# Altium schematic sheet Sheet1.SchDoc
size A4
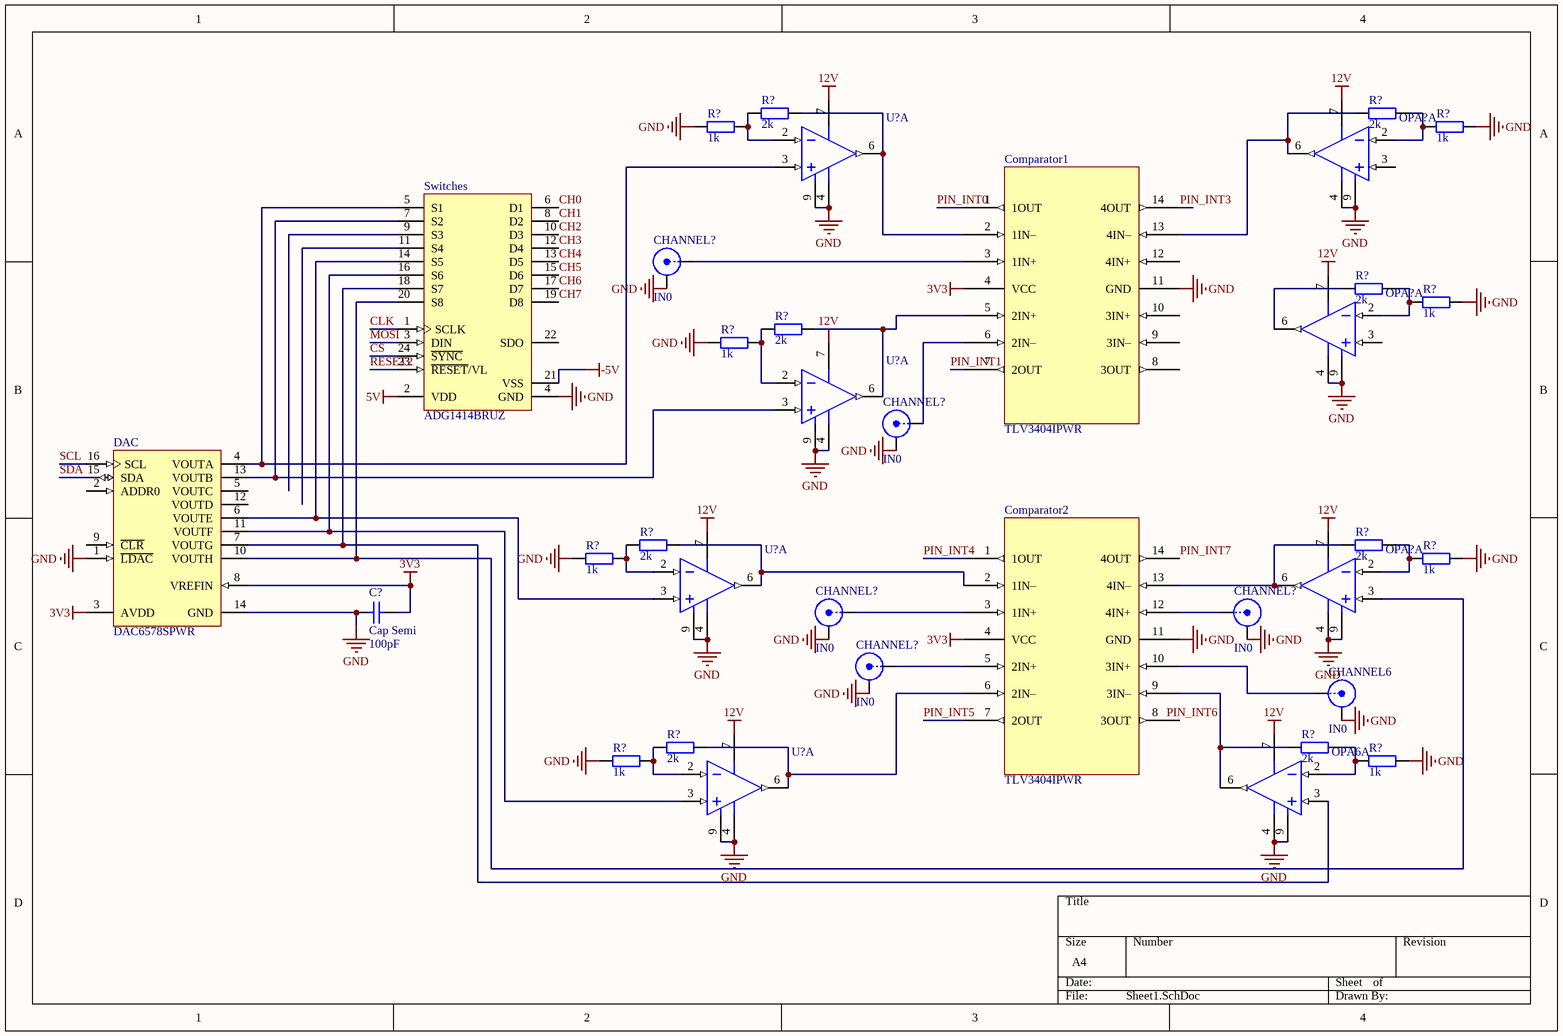
[diagram p0: Sheet1.SchDoc]

## Parts
(Parts that share a designator on the sheet are numbered #1, #2 ... from top to bottom, then left to right.)
C?  Cap Semi  value 100pF  [C1206]
CHANNEL6  IN0  [SMB]
CHANNEL?#1  IN0  [SMB]
CHANNEL?#2  IN0  [SMB]
CHANNEL?#3  IN0  [SMB]
CHANNEL?#4  IN0  [SMB]
CHANNEL?#5  IN0  [SMB]
Comparator1  TLV3404IPWR  [TSSOP-14]
Comparator2  TLV3404IPWR  [TSSOP-14]
DAC  DAC6578SPWR  [TI-PW16_N]
OPA6  THS3001IDGNG4  [TI-DGN8-1760X1425TP_M]  (value not drawn)  (part A of 2)
OPA?#1  THS3001IDGNG4  [TI-DGN8-1760X1425TP_M]  (value not drawn)  (part A of 2)
OPA?#2  THS3001IDGNG4  [TI-DGN8-1760X1425TP_M]  (value not drawn)  (part A of 2)
OPA?#3  THS3001IDGNG4  [TI-DGN8-1760X1425TP_M]  (value not drawn)  (part A of 2)
R?#1  value 2k  [0805]  (hidden comment: 1k-0W25-0805)
R?#2  value 2k  [0805]  (hidden comment: 1k-0W25-0805)
R?#3  value 1k  [0805]  (hidden comment: 1k-0W25-0805)
R?#4  value 1k  [0805]  (hidden comment: 1k-0W25-0805)
R?#5  value 2k  [0805]  (hidden comment: 1k-0W25-0805)
R?#6  value 1k  [0805]  (hidden comment: 1k-0W25-0805)
R?#7  value 2k  [0805]  (hidden comment: 1k-0W25-0805)
R?#8  value 1k  [0805]  (hidden comment: 1k-0W25-0805)
R?#9  value 2k  [0805]  (hidden comment: 1k-0W25-0805)
R?#10  value 2k  [0805]  (hidden comment: 1k-0W25-0805)
R?#11  value 1k  [0805]  (hidden comment: 1k-0W25-0805)
R?#12  value 1k  [0805]  (hidden comment: 1k-0W25-0805)
R?#13  value 2k  [0805]  (hidden comment: 1k-0W25-0805)
R?#14  value 2k  [0805]  (hidden comment: 1k-0W25-0805)
R?#15  value 1k  [0805]  (hidden comment: 1k-0W25-0805)
R?#16  value 1k  [0805]  (hidden comment: 1k-0W25-0805)
Switches  ADG1414BRUZ  [ADI-RU-24_N]
U?#1  THS3001IDGNG4  [TI-DGN8-1760X1425TP_M]  (value not drawn)  (part A of 2)
U?#2  THS3001IDGNG4  [TI-DGN8-1760X1425TP_M]  (value not drawn)  (part A of 2)
U?#3  THS3001IDGNG4  [TI-DGN8-1760X1425TP_M]  (value not drawn)  (part A of 2)
U?#4  THS3001IDGNG4  [TI-DGN8-1760X1425TP_M]  (value not drawn)  (part A of 2)

## Nets
3V3: C?.2 Comparator1.4(VCC) Comparator2.4(VCC) DAC.3(AVDD) DAC.8(VREFIN)
5V: Switches.2(VDD)
12V: OPA6.7(VCC+) OPA?#1.7(VCC+) OPA?#2.7(VCC+) OPA?#3.7(VCC+) U?#1.7(VCC+) U?#2.7(VCC+) U?#3.7(VCC+) U?#4.7(VCC+)
-5V: Switches.21(VSS)
GND: C?.1 CHANNEL6.2(Y) CHANNEL?#1.2(Y) CHANNEL?#2.2(Y) CHANNEL?#3.2(Y) CHANNEL?#4.2(Y) CHANNEL?#5.2(Y) Comparator1.11(GND) Comparator2.11(GND) DAC.1(~{LDAC}) DAC.14(GND) OPA6.4(VCC-) OPA6.9(EP) OPA?#1.4(VCC-) OPA?#1.9(EP) OPA?#2.4(VCC-) OPA?#2.9(EP) OPA?#3.4(VCC-) OPA?#3.9(EP) R?#3.1 R?#4.2 R?#6.2 R?#8.1 R?#11.1 R?#12.2 R?#15.1 R?#16.2 Switches.4(GND) U?#1.4(VCC-) U?#1.9(EP) U?#2.4(VCC-) U?#2.9(EP) U?#3.4(VCC-) U?#3.9(EP) U?#4.4(VCC-) U?#4.9(EP)
CH0: Switches.6(D1)
CH1: Switches.8(D2)
CH2: Switches.10(D3)
CH3: Switches.12(D4)
CH4: Switches.13(D5)
CH5: Switches.15(D6)
CH6: Switches.17(D7)
CH7: Switches.19(D8)
CLK: Switches.1(SCLK)
CS: Switches.24(~{SYNC})
MOSI: Switches.3(DIN)
PIN_INT0: Comparator1.1(1OUT)
PIN_INT1: Comparator1.7(2OUT)
PIN_INT3: Comparator1.14(4OUT)
PIN_INT4: Comparator2.1(1OUT)
PIN_INT5: Comparator2.7(2OUT)
PIN_INT7: Comparator2.14(4OUT)
RESET2: Switches.23(~{RESET}/VL)
SCL: DAC.16(SCL)
SDA: DAC.15(SDA)
NetCHANNEL6_1: CHANNEL6.1(X) Comparator2.10(3IN+)
NetCHANNEL?#1_1: CHANNEL?#1.1(X) Comparator1.3(1IN+)
NetCHANNEL?#2_1: CHANNEL?#2.1(X) Comparator1.6(2IN–)
NetCHANNEL?#3_1: CHANNEL?#3.1(X) Comparator2.3(1IN+)
NetCHANNEL?#4_1: CHANNEL?#4.1(X) Comparator2.12(4IN+)
NetCHANNEL?#5_1: CHANNEL?#5.1(X) Comparator2.5(2IN+)
NetComparator1_2: Comparator1.2(1IN–) R?#1.2 U?#1.6(OUT)
NetComparator1_5: Comparator1.5(2IN+) R?#7.2 U?#2.6(OUT)
NetComparator1_13: Comparator1.13(4IN–) OPA?#1.6(OUT) R?#2.1
NetComparator2_2: Comparator2.2(1IN–) R?#9.2 U?#3.6(OUT)
NetComparator2_6: Comparator2.6(2IN–) R?#13.2 U?#4.6(OUT)
NetComparator2_9: Comparator2.9(3IN–) OPA6.6(OUT) R?#14.1
NetComparator2_13: Comparator2.13(4IN–) OPA?#3.6(OUT) R?#10.1
NetDAC_4: DAC.4(VOUTA) Switches.5(S1) U?#1.3(IN+)
NetDAC_6: DAC.6(VOUTE) Switches.14(S5) U?#3.3(IN+)
NetDAC_7: DAC.7(VOUTG) OPA6.3(IN+) Switches.18(S7)
NetDAC_10: DAC.10(VOUTH) OPA?#3.3(IN+) Switches.20(S8)
NetDAC_11: DAC.11(VOUTF) Switches.16(S6) U?#4.3(IN+)
NetDAC_13: DAC.13(VOUTB) Switches.7(S2) U?#2.3(IN+)
NetOPA6_2: OPA6.2(IN-) R?#14.2 R?#16.1
NetOPA?#1_2: OPA?#1.2(IN-) R?#2.2 R?#4.1
NetOPA?#2_2: OPA?#2.2(IN-) R?#5.2 R?#6.1
NetOPA?#2_6: OPA?#2.6(OUT) R?#5.1
NetOPA?#3_2: OPA?#3.2(IN-) R?#10.2 R?#12.1
NetR?#1_1: R?#1.1 R?#3.2 U?#1.2(IN-)
NetR?#7_1: R?#7.1 R?#8.2 U?#2.2(IN-)
NetR?#9_1: R?#9.1 R?#11.2 U?#3.2(IN-)
NetR?#13_1: R?#13.1 R?#15.2 U?#4.2(IN-)

Not connected (* = marked no-connect by the designer): Comparator1 8(3OUT) 9(3IN–) 10(3IN+) 12(4IN+); Comparator2 8(3OUT); DAC 2(ADDR0) 5(VOUTC) 9(~{CLR}) 12(VOUTD); OPA?#1 3(IN+); OPA?#2 3(IN+); Switches 9(S3) 11(S4) 22(SDO)

## Notes on the sheet
- Labels drawn without touching a wire or pin: PIN_INT6

## Library data of the parts
C? = Cap Semi: Capacitor (Semiconductor SIM Model); Published: 8-Jun-2000; LatestRevisionDate: 29-May-2009; LatestRevisionNote: IPC-7351 Footprint Added.; PackageReference: C1206; Publisher: Altium Limited; PackageDescription: Chip Capacitor
CHANNEL6 CHANNEL?#1-CHANNEL?#5 = SMB: SMB Straight Connector; LatestRevisionDate: 17-Jul-2002; LatestRevisionNote: Re-released for DXP Platform.; Publisher: Altium Limited; Supplier 1: Farnell; Supplier Part Number 1: 1206013
DAC = CMP-0004-01130-1: 10-Bit, Octal Channel, Ultra-Low Glitch, Voltage Output, 2-Wire Interface DAC, -40 to 125 degC, 16-pin SOP (PW16), Green (RoHS & no Sb/Br); Manufacturer: Texas Instruments; DAC Channels: 8; INL(Max)(+/-LSB): 0.5; Power Consumption(Typ)(mW): 3.67; Resolution(Bits): 10; SubFamily: Precision DAC (=<10MSPS); Settling Time(us): 7; Interface: Serial I2C; DatasheetVersion: SBAS496A; ComponentLink3Description: Package Specification; Mounting Technology: Surface Mount; ComponentLink1URL: http://www.ti.com/; ComponentLink2Description: Datasheet; Code_JEDEC: MO-153; ComponentLink2URL: http://www.ti.com/general/docs/lit/getliterature.tsp?genericPartNumber=DAC6578&fileType=pdf; ComponentLink3URL: http://www.ti.com/lit/ml/mpds361/mpds361.pdf; DNL(Max)(+/-LSB): 0.5; PackageReference: PW16; PackageVersion: 4040064-4/G, 02/2011; PackageDescription: 16-Pin Plastic Small Outline, Body 5 x 4.4 mm, Pitch 0.65 mm; Eco-Plan: Green (RoHS & no Sb/Br); PartNumber: DAC6578SPWR; ComponentLink1Description: Manufacturer URL
OPA6 OPA?#1-OPA?#3 U?#1-U?#4 = CMP-0016-00120-1: 420 MHz Current-Feedback Amplifier, 9 to 32 V, -40 to 85 degC, 8-pin SOP (DGN8), Green (RoHS & no Sb/Br); Manufacturer: Texas Instruments; Diff Gain(%): 0.01; Iq per channel(Max)(mA): 10; Vs(Min)(V): 9; Acl, min stable gain(V/V): 1; BW @ Acl(MHz): 420; @ MHz: 5; 2nd Harmonic(dBc): 91; Vio(Max)(mV): 3; 3rd Harmonic(dBc): 86; Vn at Flatband(Typ)(nV/rtHz): 1.6; Slew Rate(Typ)(V/us): 6500; THD (Fc is 1 MHz)(Typ)(dB): -96; Iib(Max)(nA): 15000; Sub Family: High Output Current Amplifier (>=50mA), High Speed Amplifier (>=50MHz), High Supply Voltage Amplifier (>=30V); Vs(Max)(V): 32; Diff Phase(deg): 0.02; Settling Time (0.1%)(Typ)(ns): 40; Io(Typ)(mA): 120; PackageDescription: 8-pin Plastic Small Outline, Body 3 x 3 mm, Pitch 0.65 mm; Eco-Plan: Green (RoHS & no Sb/Br); ComponentLink3Description: Package Specification; ComponentLink3URL: http://www.ti.com/litv/pdf/mpds046e; Mounting Technology: Surface Mount; ComponentLink2URL: http://www.ti.com/general/docs/lit/getliterature.tsp?genericPartNumber=THS3001&fileType=pdf; ComponentLink1Description: Manufacturer URL; PartNumber: THS3001IDGNG4; PackageReference: DGN8-1760X1425TP; Code_JEDEC: MO-187; ComponentLink2Description: Datasheet; Number of Channels: 1; PackageVersion: 4073271/F, 05/2011; ComponentLink1URL: http://www.ti.com/; DatasheetVersion: SLOS217H
R?#1-R?#16 = 1k-0W25-0805: Resistor; Published: 8-Jun-2000; LatestRevisionDate: 17-Jul-2002; LatestRevisionNote: Re-released for DXP Platform.; PackageReference: AXIAL-0.4; Publisher: Altium Limited
  R?#3 R?#4 R?#6 R?#8 R?#11 R?#12 R?#15 R?#16: Supplier Part Number 1: 1750754
Switches = CMP-0790-00247-1: 9.5 Ohm RON +/-15 V / +12 V / +/-5 V iCMOS Serially-Controlled Octal SPST Switch, -40 to 125 degC, 24-pin SOP (RU-24), Tube; Manufacturer: Analog Devices; Is OFF: 50pA, 20pA, 20pA; Id, Is (ON): 100pA, 50pA, 50pA; Ron (ohms): 9.5; Power Dissipation: 2.8mW; Configuration: SPST; ComponentLink2Description: Datasheet; PackageReference: RU-24; ComponentLink1URL: http://www.analog.com/en/index.html; ComponentLink2URL: http://www.analog.com/static/imported-files/data_sheets/ADG1414.pdf; Mounting Technology: Surface Mount; Code_JEDEC: MO-153AD; Packing: Tube; DatasheetVersion: Rev. 0; PackageDescription: 24-Pin Thin Shrink Small Outline Package, Body 7.8 x 4.4 mm, Pitch 0.65 mm; PackageVersion: Nov-02; ComponentLink3URL: http://www.analog.com/static/imported-files/packages/380523655245964505593671154107510036154RU24.pdf; ComponentLink1Description: Manufacturer URL; PartNumber: ADG1414BRUZ; ComponentLink3Description: Package Specification